# Altium schematic sheet RTC.SchDoc
size A4; SheetNumber: 4; SheetTotal: 7; SPICEModelCacheIPIYUYAV: <root> / <DocumentId>IPIYUYAV</DocumentId> / </root>
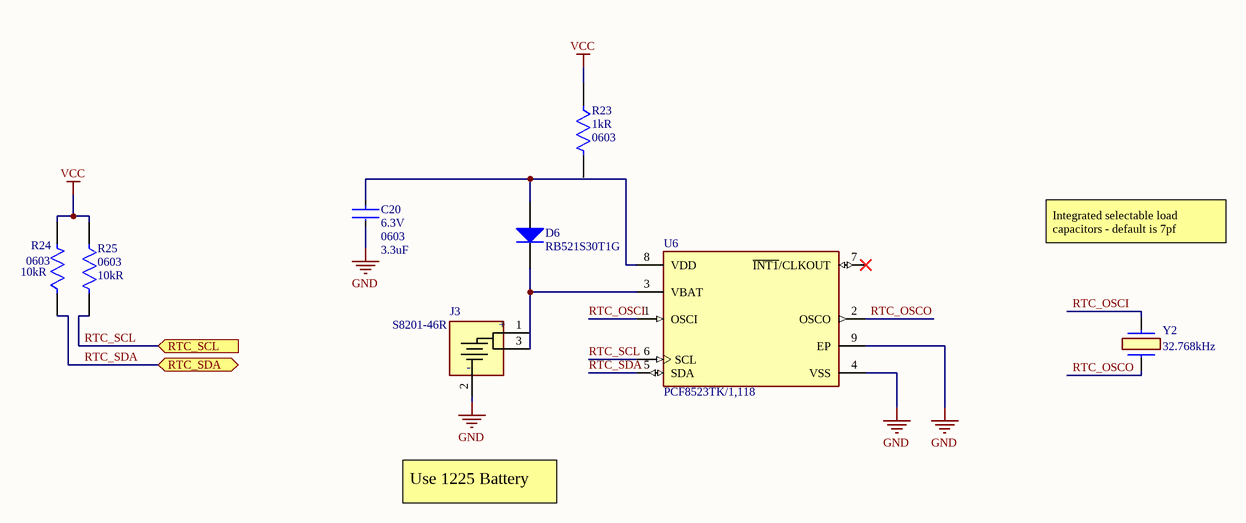
[diagram p0: RTC.SchDoc]

## Parts
C20  Voltage Rating: 6.3V  Case Code (Imperial): 0603  Capacitance: 3.3uF  [FP-C1608-080-0_1-MFG]  (hidden comment: C1608X7S0J335K080AC)
D6  RB521S30T1G  [ONSC-SOD-523-2-502-01_V]
J3  S8201-46R  [S8201-46R]
R23  Resistance: 1kR  Size Code: 0603  [FP-RC0603-0_55-IPC_C]  (hidden comment: RC0603FR-071KL)
R24  Case Code (Imperial): 0603  Resistance: 10kR  [FP-RMCF0603-MFG]  (hidden comment: RMCF0603JG10K0)
R25  Case Code (Imperial): 0603  Resistance: 10kR  [FP-RMCF0603-MFG]  (hidden comment: RMCF0603JG10K0)
U6  PCF8523TK/1,118  [FP-SOT909-1-MFG]
Y2  Frequency: 32.768kHz  [CM8V32768TA020125]  (hidden comment: CM8V-T1A-32.768kHz-7pF-20PPM-TA-QC)

## Ports
RTC_SCL (in), RTC_SDA (bidir)

## Nets
GND: C20.1 J3.2 U6.4(VSS) U6.9(EP)
VCC: R23.1 R24.2 R25.1
RTC_OSCI: U6.1(OSCI) Y2.?1
RTC_OSCO: U6.2(OSCO) Y2.2(X2)
RTC_SCL: R25.2 U6.6(SCL) ; port RTC_SCL
RTC_SDA: R24.1 U6.5(SDA) ; port RTC_SDA
NetC20_2: C20.2 D6.2(A) U6.8(VDD)
NetD6_1: D6.1(K) J3.1 J3.3 U6.3(VBAT)

Not connected (* = marked no-connect by the designer): R23 2; U6 7(~{INT1}/CLKOUT)*

## Notes on the sheet
- Integrated selectable load capacitors - default is 7pf
- Use 1225 Battery
- (in symbol S8201-46R) +; -

## Library data of the parts
C20 = CMP-08246-006760-1: Multilayer Ceramic Capacitors 3.3μF ±10% 6.3V X7S SMD 0603; Max Operating Temperature: 125°C; Lead Free: Lead Free; Min Operating Temperature: -55°C; Dielectric Material: Ceramic; Voltage Rating (DC): 6.3V; Case/Package: 0603; Thickness: 0.035inch; RoHS Compliant: Yes; Mount: Surface Mount; Width: 0.031inch; Tolerance: 10%; Case Code (Metric): 1608; Package Quantity: 4000; Series: C; Length: 0.063inch; Packaging: Tape and Reel
D6 = CMP-1051-00018-1: Schottky Barrier Diode, 2-Pin SOD-523, Pb-Free, Tape and Reel; Manufacturer: On Semiconductor; Configuration: Single; IFSM Max (A): 1; Mounting Technology: Surface Mount; ComponentLink1Description: Manufacturer URL; PackageReference: SOD-523-2-502-01; RoHS: TRUE; ComponentLink3Description: Package Specification; ComponentLink2Description: Datasheet; PackageVersion: Rev. E, 09/2010; PartNumber: RB521S30T1G; ComponentLink3URL: http://www.onsemi.com/pub_link/Collateral/502-01.PDF; ComponentLink1URL: http://www.onsemi.com/; PackageDescription: 2-Pin SOD, Body 1.2 x 0.8 mm; DatasheetVersion: Rev. 8; ComponentLink2URL: http://www.onsemi.cn/pub_link/Collateral/RB521S30T1-D.PDF; Packing: Tape and Reel
J3 = S8201-46R: Connector; Manufacturer_Name: Harwin; Datasheet Link: https://cdn.harwin.com/pdfs/S8201R.pdf; Manufacturer_Part_Number: S8201-46R; Mouser Part Number: 855-S8201-46R; Mouser Price/Stock: https://www.mouser.co.uk/ProductDetail/Harwin/S8201-46R?qs=UmERj8vReOlBAjlRZWzWbg%3D%3D
R23 = CMP-1659-00009-5: RES 1K OHM 1% 1/10W 0603; Voltage Rating: 50V; Power Rating: 100mW; Temperature Coefficient: 100ppm/°C; Military Standard: Not; REACH SVHC: No SVHC; Features: Moisture Resistant; Number of Terminations: 2; Technology: THICK FILM; Series: RC; Case Code (Metric): 1608; Resistance Tolerance: 1%; Resistor Type: Thick Film; Termination: SMD/SMT; Contact Plating: Tin; Radiation Hardening: No; Min Operating Temperature: -55°C; Max Operating Temperature: 155°C; Packaging: Tape and Reel; Max Power Dissipation: 100mW; RoHS Compliant: Yes; Height: 0.45mm; Lead Free: Lead Free; Case/Package: 0603; Length: 1.6mm; Tolerance: 1%; Case Code (Imperial): 0603; Construction: Rectangular; Depth: 0.8mm
R24 R25 = CMP-26527-000153-1: 10kΩ ±5% 0.1W 0603 Thick Film Chip Resistor AEC-Q200 compliant; Temperature Coefficient: 200ppm/°C; Max Power Dissipation: 100mW; Tolerance: 5%; Series: RMCF; Resistor Type: Thick Film; Length: 0.061inch; Features: Automotive AEC-Q200; Height: 0.022inch; Case Code (Metric): 1608; Width: 0.031inch; Number of Terminations: 2; Contact Plating: Tin; Case/Package: 0603; Package Quantity: 1; Max Operating Temperature: 155°C; Mount: Surface Mount; RoHS Compliant: Yes; Radiation Hardening: No; Min Operating Temperature: -55°C; Packaging: Tape and Reel
U6 = CMP-10083-000004-1: IC RTC CLK/CALENDAR I2C 8-HVSON; Manufacturer: NXP Semiconductors; Standoff Height: 0mm; Nominal Supply Current: 0.15-1.2uA; Number Of Outputs: 1; Min Supply Voltage: 1V; Max Supply Voltage: 5.5V; Category: IC; Ipc Land Pattern Name: DFN400X400X100-8; Manufacturer Part Number: PCF8523TK/1,118; Temperature Range Low: -40°C; Automotive: No; Package: SOT909-1; Height: 1mm; Ambient Temperature Range High: +85°C; Digikey Description: IC RTC CLK/CALENDAR I2C 8-HVSON; Device Class L3: Real Time Clocks; Device Class L1: Integrated Circuits (ICs); Temperature Range High: +85°C; Device Class L2: Clock and Timing; Ambient Temperature Range Low: -40°C; Interface: I2C; Temperature: -40°C to +85°C; ComponentLink2Description: Datasheet; Octopart: https://octopart.com/pcf8523tk%2F1%2C118-nxp+semiconductors-19647992; Mouser Description: Real Time Clock REAL-TIME CLOCK (RTC) AND CALENDAR; Footprint Url: https://www.nxp.com/docs/en/package-information/SOT909-1.pdf; RoHS: TRUE; ComponentLink2URL: https://www.nxp.com/docs/en/data-sheet/PCF8523.pdf; Lead Free: Yes
Y2 = CM8V-T1A-32.768kHz-7pF-20PPM-TA-QC: Crystal or Oscillator; Manufacturer_Name: Micro Crystal AG; Datasheet Link: https://www.mouser.de/datasheet/2/530/CM8V_T1A-1510858.pdf; Height: 0.6mm; Manufacturer_Part_Number: CM8V-T1A-32.768kHz-7pF-20PPM-TA-QC; Mouser Part Number: 428-201436-MC01; Mouser Price/Stock: https://www.mouser.co.uk/ProductDetail/Micro-Crystal/CM8V-T1A-32.768kHz-7pF-20PPM-TA-QC?qs=7bTaA%2FLYtSYyZWzzv04BxA%3D%3D; Arrow Part Number: CM8V-T1A-32.768KHZ-7PF-20PPM-TA-QC; Arrow Price/Stock: https://www.arrow.com/en/products/cm8v-t1a-32.768khz-7pf-20ppm-ta-qc/micro-crystal-ag?region=nac